# EAGLE design esp-adap (EAGLE 8.0.0)
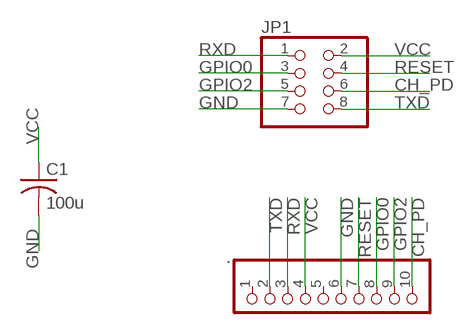
[diagram p0: schematic, sheet 1]

## Parts
.  PINHD-1X10  [1X10]
C1  100u  C-USC1206K  [C1206K]
JP1  PINHD-2X4  [2X04]

## Nets
CH_PD: ..10 JP1.6
GND: ..6 C1.2 JP1.7
GPIO0: ..8 JP1.3
GPIO2: ..9 JP1.5
RESET: ..7 JP1.4
RXD: ..3 JP1.1
TXD: ..2 JP1.8
VCC: ..4 C1.1 JP1.2
Unconnected: ..1 ..5

## Library data of the parts
. = pinhead:PINHD-1X10: PIN HEADER
C1 = resistor:C-US: CAPACITOR, American symbol
JP1 = pinhead:PINHD-2X4: PIN HEADER

## Board
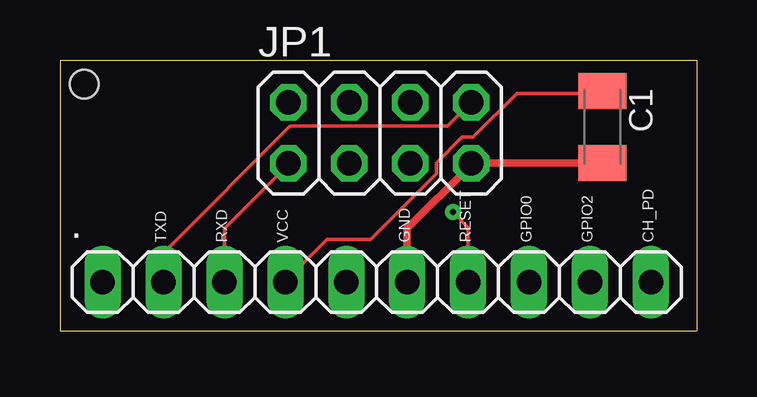
[diagram p1: board, top side]
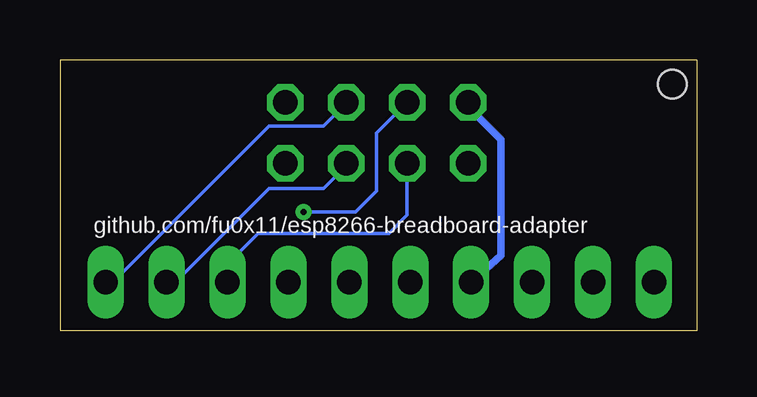
[diagram p2: board, bottom side, seen from below]

Size 26.54 x 11.3 mm. Coordinates in mm from the lower left corner, seen from the top.
Outline: 26.52,0 0,0 0,11.3 26.52,11.3
Outline: 26.54,11.3 26.54,0
Copper layers (1*16): Top 0.035mm / dielectric 1.5mm / Bottom 0.035mm
Design rules "default *": minimum track width 6mil, minimum drill 13mil, track to track 6mil, track to pad 6mil, pad to pad 6mil, via to via 8mil, smd to smd 8mil, copper to edge 40mil, drill to drill 8mil, minimum pad ring 10mil, minimum via ring 8mil, stop-mask expansion 4mil, vias tented up to drill 0mil, thermal gap 10mil
Holes 1.2 mm at 1.02,10.29

### Footprints (pad centres in the part's own frame; a part is rotated, then mirrored left to right if it is on the bottom)
1X10 = drill 1.016 long: 1 -11.43,0; 2 -8.89,0; 3 -6.35,0; 4 -3.81,0; 5 -1.27,0; 6 1.27,0; 7 3.81,0; 8 6.35,0; 9 8.89,0; 10 11.43,0
C1206K = smd 1.5 x 2: 1 -1.5,0; 2 1.5,0
2X04 = drill 1.016 octagon: 1 -3.81,-1.27; 2 -3.81,1.27; 3 -1.27,-1.27; 4 -1.27,1.27; 5 1.27,-1.27; 6 1.27,1.27; 7 3.81,-1.27; 8 3.81,1.27

### Placement (x,y rotation side)
.  13.21,2.03 0 top
C1  22.61,8.51 270 top
JP1  13.34,8.26 0 top

### Tracks (layer width: path | path; a pad name or v marks a point on that pad's centre or on a via)
CH_PD
  Bottom 0.152: ..10 24.54,2.13 24.23,2.13 17.83,8.53 15.54,8.53 14.63,9.45 JP1.6
GND
  Top 0.152: 22.55,7.01 C1.2 | 17.22,7.01 JP1.7 17.07,6.86
  Top 0.305: 17.22,7.01 22.55,7.01 | ..6 14.48,4.27 17.07,6.86
GPIO0
  Bottom 0.152: 19.56,2.79 18.29,4.06 12.83,4.06 12.06,4.83 JP1.3
  Bottom 0.305: ..8 19.56,2.79
GPIO2
  Bottom 0.152: ..9 22.1,2.13 21.64,2.13 17.83,5.94 15.54,5.94 14.63,6.86 JP1.5
RESET  (via drill 0.25)
  Top 0.152: v16.38,4.95 17.02,4.32 ..7
  Bottom 0.152: JP1.4 13.34,8.26 13.34,5.84 14.22,4.95 v16.38,4.95
RXD
  Top 0.152: ..3 6.86,4.27 9.45,6.86 JP1.1
TXD
  Top 0.152: JP1.8 16.15,8.53 9.6,8.53 4.42,3.35 4.42,2.13 ..2
VCC
  Top 0.152: C1.1 22.55,9.91 19.05,9.91 17.22,8.08 16.76,8.08 15.7,7.01 15.7,6.55 12.95,3.81 11.12,3.81 9.45,2.13 ..4
  Bottom 0.152: 9.45,9.45 JP1.2
  Bottom 0.305: 9.45,9.45 9.45,9.27 8.15,7.98 8.15,3.15 ..4

### Text on the board
tNames: TXD | RXD | VCC | GND | RESET | GPIO0 | GPIO2 | CH_PD
bNames: github.com/fu0x11/esp8266-breadboard-adapter